# EAGLE design PCB-CMB-3 (EAGLE 6.5.0)

## Sheet 1 of 2
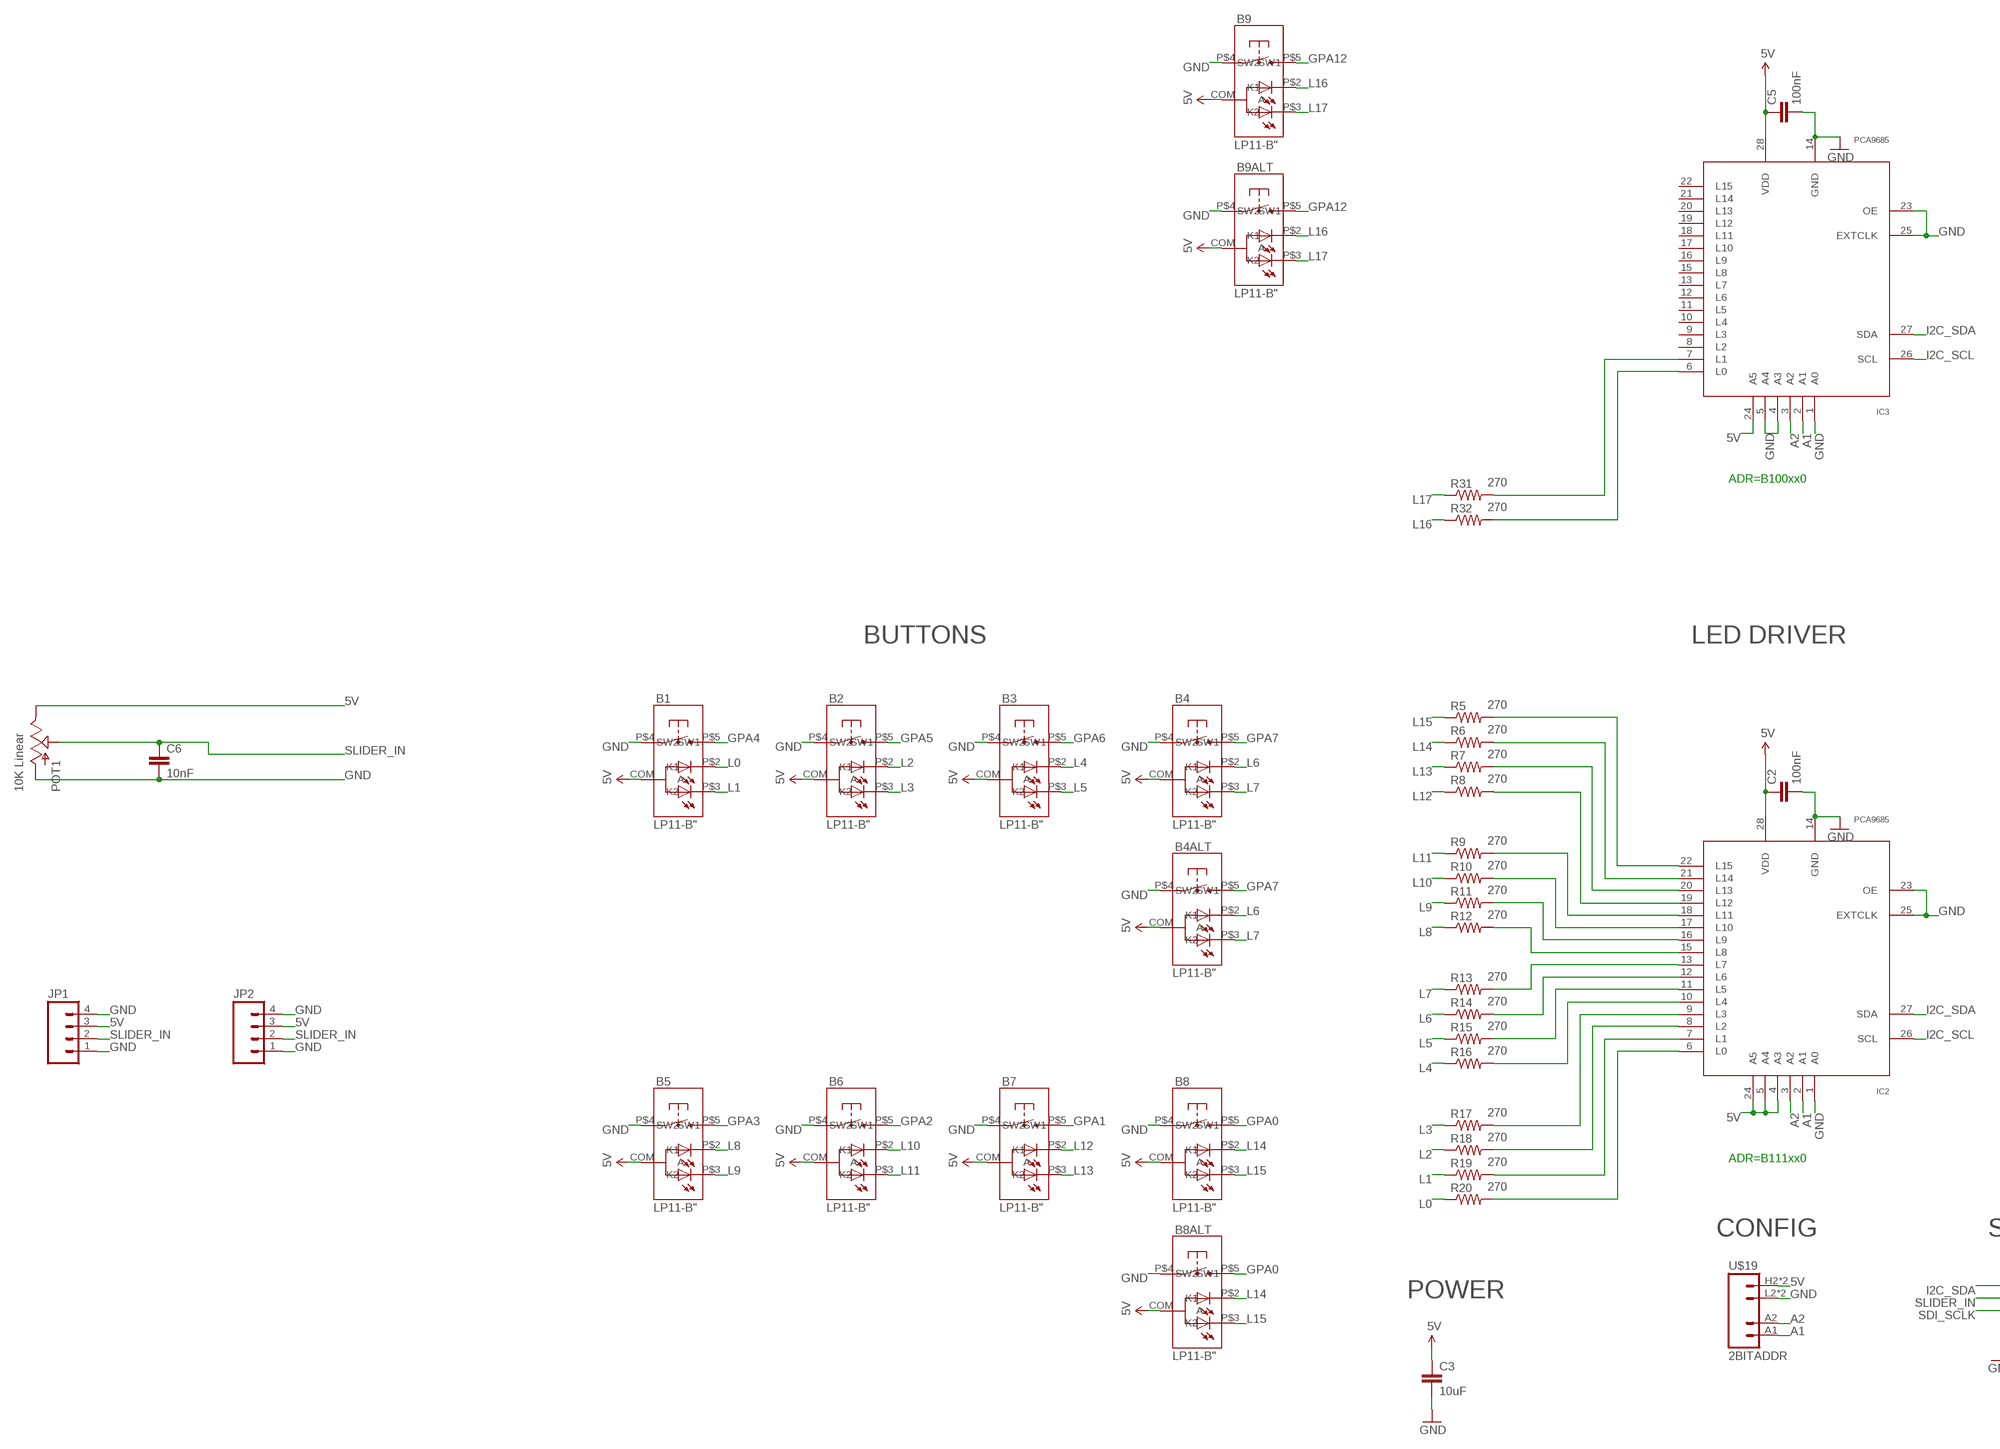
[diagram p0: schematic, sheet 1, part 1 of 2]
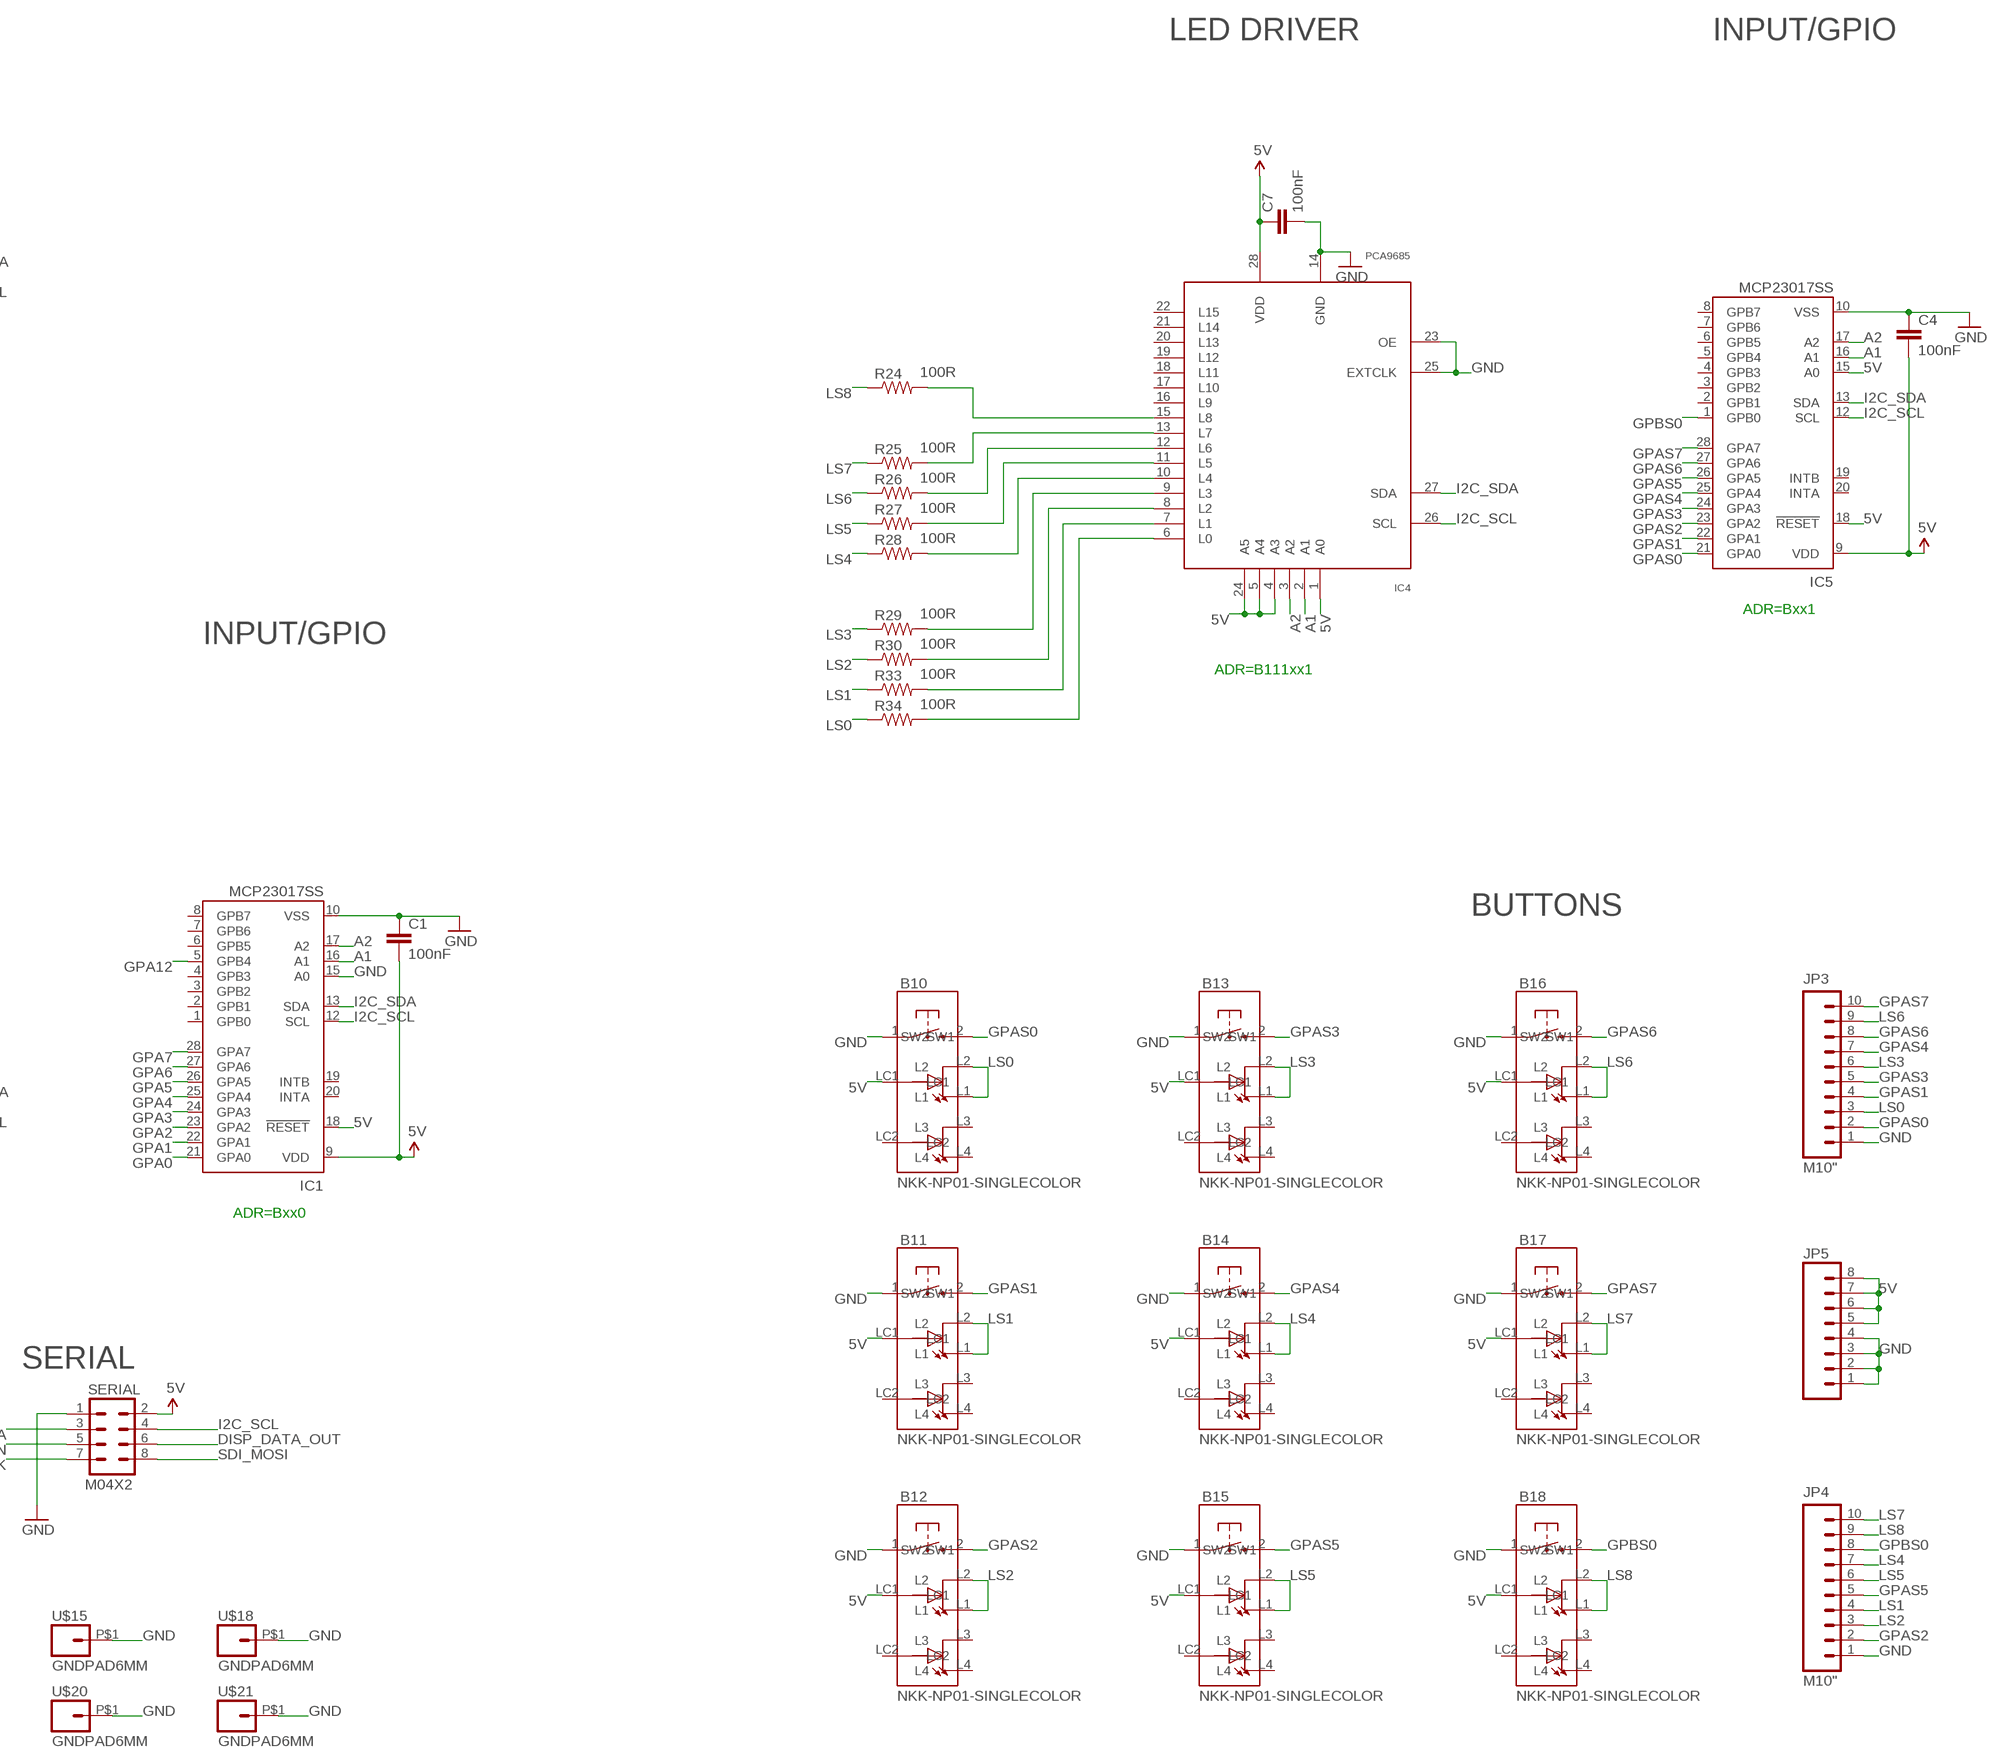
[diagram p1: schematic, sheet 1, part 2 of 2]

### Parts
B1  LP11-B"  [LP11]
B2  LP11-B"  [LP11]
B3  LP11-B"  [LP11]
B4  LP11-B"  [LP11]
B4ALT  LP11-B"  [LP11]
B5  LP11-B"  [LP11]
B6  LP11-B"  [LP11]
B7  LP11-B"  [LP11]
B8  LP11-B"  [LP11]
B8ALT  LP11-B"  [LP11]
B9  LP11-B"  [LP11]
B9ALT  LP11-B"  [LP11]
B10  NKK-NP01-SINGLECOLOR  [NKK-NP01]
B11  NKK-NP01-SINGLECOLOR  [NKK-NP01]
B12  NKK-NP01-SINGLECOLOR  [NKK-NP01]
B13  NKK-NP01-SINGLECOLOR  [NKK-NP01]
B14  NKK-NP01-SINGLECOLOR  [NKK-NP01]
B15  NKK-NP01-SINGLECOLOR  [NKK-NP01]
B16  NKK-NP01-SINGLECOLOR  [NKK-NP01]
B17  NKK-NP01-SINGLECOLOR  [NKK-NP01]
B18  NKK-NP01-SINGLECOLOR  [NKK-NP01]
C1  100nF  CAP0603-CAP  [0603-CAP]
C2  100nF  CAP0603-CAP  [0603-CAP]
C3  10uF  CAP0805  [0805]
C4  100nF  CAP0603-CAP  [0603-CAP]
C5  100nF  CAP0603-CAP  [0603-CAP]
C6  10nF  CAP0603-CAP  [0603-CAP]
C7  100nF  CAP0603-CAP  [0603-CAP]
IC1  MCP23017SS  [SSOP28]
IC2  PCA9685  [TSSOP28]
IC3  PCA9685  [TSSOP28]
IC4  PCA9685  [TSSOP28]
IC5  MCP23017SS  [SSOP28]
JP1  M04PTH  [1X04]
JP2  M04PTH  [1X04]
JP3  M10"  [1X10]
JP4  M10"  [1X10]
JP5  M08LOCK  [1X08_LOCK]
POT1  10K Linear  SLIDER20  [SLIDER20]
R5  270  RESISTOR0603-RES  [0603-RES]
R6  270  RESISTOR0603-RES  [0603-RES]
R7  270  RESISTOR0603-RES  [0603-RES]
R8  270  RESISTOR0603-RES  [0603-RES]
R9  270  RESISTOR0603-RES  [0603-RES]
R10  270  RESISTOR0603-RES  [0603-RES]
R11  270  RESISTOR0603-RES  [0603-RES]
R12  270  RESISTOR0603-RES  [0603-RES]
R13  270  RESISTOR0603-RES  [0603-RES]
R14  270  RESISTOR0603-RES  [0603-RES]
R15  270  RESISTOR0603-RES  [0603-RES]
R16  270  RESISTOR0603-RES  [0603-RES]
R17  270  RESISTOR0603-RES  [0603-RES]
R18  270  RESISTOR0603-RES  [0603-RES]
R19  270  RESISTOR0603-RES  [0603-RES]
R20  270  RESISTOR0603-RES  [0603-RES]
R24  100R  RESISTOR0603-RES  [0603-RES]
R25  100R  RESISTOR0603-RES  [0603-RES]
R26  100R  RESISTOR0603-RES  [0603-RES]
R27  100R  RESISTOR0603-RES  [0603-RES]
R28  100R  RESISTOR0603-RES  [0603-RES]
R29  100R  RESISTOR0603-RES  [0603-RES]
R30  100R  RESISTOR0603-RES  [0603-RES]
R31  270  RESISTOR0603-RES  [0603-RES]
R32  270  RESISTOR0603-RES  [0603-RES]
R33  100R  RESISTOR0603-RES  [0603-RES]
R34  100R  RESISTOR0603-RES  [0603-RES]
SERIAL  M04X2  [2X4]
U$15  GNDPAD6MM  [3.2MMPAD6MM]
U$18  GNDPAD6MM  [3.2MMPAD6MM]
U$19  2BITADDR  [2BITADDR]
U$20  GNDPAD6MM  [3.2MMPAD6MM]
U$21  GNDPAD6MM  [3.2MMPAD6MM]

### Nets
5V [Power]: B1.COM(A) B2.COM(A) B3.COM(A) B4.COM(A) B4ALT.COM(A) B5.COM(A) B6.COM(A) B7.COM(A) B8.COM(A) B8ALT.COM(A) B9.COM(A) B9ALT.COM(A) B10.LC1 B11.LC1 B12.LC1 B13.LC1 B14.LC1 B15.LC1 B16.LC1 B17.LC1 B18.LC1 C1.2 C2.1 C3.1 C4.2 C5.1 C7.1 IC1.9(VDD) IC1.18(!RESET) IC2.4(A3) IC2.5(A4) IC2.24(A5) IC2.28(VDD) IC3.24(A5) IC3.28(VDD) IC4.1(A0) IC4.4(A3) IC4.5(A4) IC4.24(A5) IC4.28(VDD) IC5.9(VDD) IC5.15(A0) IC5.18(!RESET) JP1.3 JP2.3 JP5.5 JP5.6 JP5.7 JP5.8 POT1.1(E) SERIAL.2 U$19.H2(VCC) U$19.H3(VCC)
A1: IC1.16(A1) IC2.2(A1) IC3.2(A1) IC4.2(A1) IC5.16(A1) U$19.A1
A2: IC1.17(A2) IC2.3(A2) IC3.3(A2) IC4.3(A2) IC5.17(A2) U$19.A2
DISP_DATA_OUT: SERIAL.6
GND [Power]: B1.P$4(SW1) B2.P$4(SW1) B3.P$4(SW1) B4.P$4(SW1) B4ALT.P$4(SW1) B5.P$4(SW1) B6.P$4(SW1) B7.P$4(SW1) B8.P$4(SW1) B8ALT.P$4(SW1) B9.P$4(SW1) B9ALT.P$4(SW1) B10.1(SW1) B11.1(SW1) B12.1(SW1) B13.1(SW1) B14.1(SW1) B15.1(SW1) B16.1(SW1) B17.1(SW1) B18.1(SW1) C1.1 C2.2 C3.2 C4.1 C5.2 C6.2 C7.2 IC1.10(VSS) IC1.15(A0) IC2.1(A0) IC2.14(GND) IC2.23(OE) IC2.25(EXTCLK) IC3.1(A0) IC3.4(A3) IC3.5(A4) IC3.14(GND) IC3.23(OE) IC3.25(EXTCLK) IC4.14(GND) IC4.23(OE) IC4.25(EXTCLK) IC5.10(VSS) JP1.1 JP1.4 JP2.1 JP2.4 JP3.1 JP4.1 JP5.1 JP5.2 JP5.3 JP5.4 POT1.3(A) SERIAL.1 U$15.P$1 U$18.P$1 U$19.L2(GND) U$19.L3(GND) U$20.P$1 U$21.P$1
GPA0: B8.P$5(SW2) B8ALT.P$5(SW2) IC1.21(GPA0)
GPA1: B7.P$5(SW2) IC1.22(GPA1)
GPA2: B6.P$5(SW2) IC1.23(GPA2)
GPA3: B5.P$5(SW2) IC1.24(GPA3)
GPA4: B1.P$5(SW2) IC1.25(GPA4)
GPA5: B2.P$5(SW2) IC1.26(GPA5)
GPA6: B3.P$5(SW2) IC1.27(GPA6)
GPA7: B4.P$5(SW2) B4ALT.P$5(SW2) IC1.28(GPA7)
GPA12: B9.P$5(SW2) B9ALT.P$5(SW2) IC1.5(GPB4)
GPAS0: B10.2(SW2) IC5.21(GPA0) JP3.2
GPAS1: B11.2(SW2) IC5.22(GPA1) JP3.4
GPAS2: B12.2(SW2) IC5.23(GPA2) JP4.2
GPAS3: B13.2(SW2) IC5.24(GPA3) JP3.5
GPAS4: B14.2(SW2) IC5.25(GPA4) JP3.7
GPAS5: B15.2(SW2) IC5.26(GPA5) JP4.5
GPAS6: B16.2(SW2) IC5.27(GPA6) JP3.8
GPAS7: B17.2(SW2) IC5.28(GPA7) JP3.10
GPBS0 [Power]: B18.2(SW2) IC5.1(GPB0) JP4.8
I2C_SCL: IC1.12(SCL) IC2.26(SCL) IC3.26(SCL) IC4.26(SCL) IC5.12(SCL) SERIAL.4
I2C_SDA: IC1.13(SDA) IC2.27(SDA) IC3.27(SDA) IC4.27(SDA) IC5.13(SDA) SERIAL.3
L0: B1.P$2(K1) R20.1
L1: B1.P$3(K2) R19.1
L2: B2.P$2(K1) R18.1
L3: B2.P$3(K2) R17.1
L4: B3.P$2(K1) R16.1
L5: B3.P$3(K2) R15.1
L6: B4.P$2(K1) B4ALT.P$2(K1) R14.1
L7: B4.P$3(K2) B4ALT.P$3(K2) R13.1
L8: B5.P$2(K1) R12.1
L9: B5.P$3(K2) R11.1
L10: B6.P$2(K1) R10.1
L11: B6.P$3(K2) R9.1
L12: B7.P$2(K1) R8.1
L13: B7.P$3(K2) R7.1
L14: B8.P$2(K1) B8ALT.P$2(K1) R6.1
L15: B8.P$3(K2) B8ALT.P$3(K2) R5.1
L16: B9.P$2(K1) B9ALT.P$2(K1) R32.1
L17: B9.P$3(K2) B9ALT.P$3(K2) R31.1
LS0: B10.L1 B10.L2 JP3.3 R34.1
LS1: B11.L1 B11.L2 JP4.4 R33.1
LS2: B12.L1 B12.L2 JP4.3 R30.1
LS3: B13.L1 B13.L2 JP3.6 R29.1
LS4: B14.L1 B14.L2 JP4.7 R28.1
LS5: B15.L1 B15.L2 JP4.6 R27.1
LS6: B16.L1 B16.L2 JP3.9 R26.1
LS7: B17.L1 B17.L2 JP4.10 R25.1
LS8: B18.L1 B18.L2 JP4.9 R24.1
N$1: IC4.13(L7) R25.2
N$2: IC4.12(L6) R26.2
N$3: IC4.11(L5) R27.2
N$4: IC2.13(L7) R13.2
N$5: IC2.12(L6) R14.2
N$6: IC4.10(L4) R28.2
N$7: IC2.11(L5) R15.2
N$8: IC4.9(L3) R29.2
N$9: IC2.10(L4) R16.2
N$10: IC2.9(L3) R17.2
N$11: IC2.8(L2) R18.2
N$12: IC2.7(L1) R19.2
N$13: IC4.8(L2) R30.2
N$14: IC3.7(L1) R31.2
N$15: IC3.6(L0) R32.2
N$16: IC4.7(L1) R33.2
N$17: IC4.6(L0) R34.2
N$18: IC4.15(L8) R24.2
N$19: IC2.6(L0) R20.2
N$20: IC2.15(L8) R12.2
N$21: IC2.16(L9) R11.2
N$22: IC2.17(L10) R10.2
N$23: IC2.18(L11) R9.2
N$24: IC2.19(L12) R8.2
N$25: IC2.20(L13) R7.2
N$26: IC2.21(L14) R6.2
N$27: IC2.22(L15) R5.2
SDI_MOSI: SERIAL.8
SDI_SCLK: SERIAL.7
SLIDER_IN: C6.1 JP1.2 JP2.2 POT1.2A(S) SERIAL.5
Unconnected: B10.L3 B10.L4 B10.LC2 B11.L3 B11.L4 B11.LC2 B12.L3 B12.L4 B12.LC2 B13.L3 B13.L4 B13.LC2 B14.L3 B14.L4 B14.LC2 B15.L3 B15.L4 B15.LC2 B16.L3 B16.L4 B16.LC2 B17.L3 B17.L4 B17.LC2 B18.L3 B18.L4 B18.LC2 IC1.1(GPB0) IC1.2(GPB1) IC1.3(GPB2) IC1.4(GPB3) IC1.6(GPB5) IC1.7(GPB6) IC1.8(GPB7) IC1.19(INTB) IC1.20(INTA) IC3.8(L2) IC3.9(L3) IC3.10(L4) IC3.11(L5) IC3.12(L6) IC3.13(L7) IC3.15(L8) IC3.16(L9) IC3.17(L10) IC3.18(L11) IC3.19(L12) IC3.20(L13) IC3.21(L14) IC3.22(L15) IC4.16(L9) IC4.17(L10) IC4.18(L11) IC4.19(L12) IC4.20(L13) IC4.21(L14) IC4.22(L15) IC5.2(GPB1) IC5.3(GPB2) IC5.4(GPB3) IC5.5(GPB4) IC5.6(GPB5) IC5.7(GPB6) IC5.8(GPB7) IC5.19(INTB) IC5.20(INTA)

### Notes on the sheet
- LED DRIVER | INPUT/GPIO
- ADR=B100xx0
- ADR=Bxx1
- BUTTONS | LED DRIVER | INPUT/GPIO
- ADR=B111xx1
- BUTTONS
- ADR=Bxx0
- ADR=B111xx0
- CONFIG | SERIAL
- POWER

## Sheet 2 of 2

## Library data of the parts
B1-B4 B4ALT B5-B8 B8ALT B9 B9ALT = SKAARHOJ:LP11-B
B10-B18 = SKAARHOJ:NKK-NP01-SINGLECOLOR
C1-C7 = SparkFun:CAP: Capacitor Standard 0603 ceramic capacitor, and 0.1" leaded capacitor.
IC1 IC5 = microchip:MCP23017: http://ww1.microchip.com/downloads/en/DeviceDoc/21952a.pdf Source: http://ww1.microchip.com/downloads/en/DeviceDoc/21952a.pdf; MF: MICROCHIP; MPN: MCP23017-E/SS; OC_FARNELL: 1467674; OC_NEWARK: 31K2960
IC2-IC4 = wsmith:PCA9685
JP1 JP2 = SparkFun:M04: Header 4 Standard 4-pin 0.1" header. Use with straight break away headers (SKU : PRT-00116), right angle break away headers (PRT-00553), swiss pins (PRT-00743), machine pins (PRT-00117), and female headers (PRT-00115). Molex polarized connector foot print use with SKU : PRT-08231 with associated crimp pins and housings. 1MM SMD Version SKU: PRT-10208
JP3 JP4 = SparkFun:M10: Header 10 Standard 10-pin 0.1" header. Use with straight break away headers (SKU : PRT-00116), right angle break away headers (PRT-00553), swiss pins (PRT-00743), machine pins (PRT-00117), and female headers (PRT-00115).
JP5 = SparkFun:M08: Header 8 Standard 8-pin 0.1" header. Use with straight break away headers (SKU : PRT-00116), right angle break away headers (PRT-00553), swiss pins (PRT-00743), machine pins (PRT-00117), and female headers (PRT-00115).
POT1 = SKAARHOJ:SLIDER
R5-R20 R24-R34 = SparkFun:RESISTOR: Resistor Basic schematic elements and footprints for 0603, 1206, and PTH resistors.
SERIAL = SparkFun:M04X2
U$15 U$18 U$20 U$21 = SKAARHOJ:GNDPAD
U$19 = SKAARHOJ:2BITADDR

## Net classes
0 default: width 0.203 mm, drill 0.406 mm, clearance 0.203 mm
1 Power: width 0.406 mm, drill 0.61 mm, clearance 0.203 mm

## Board
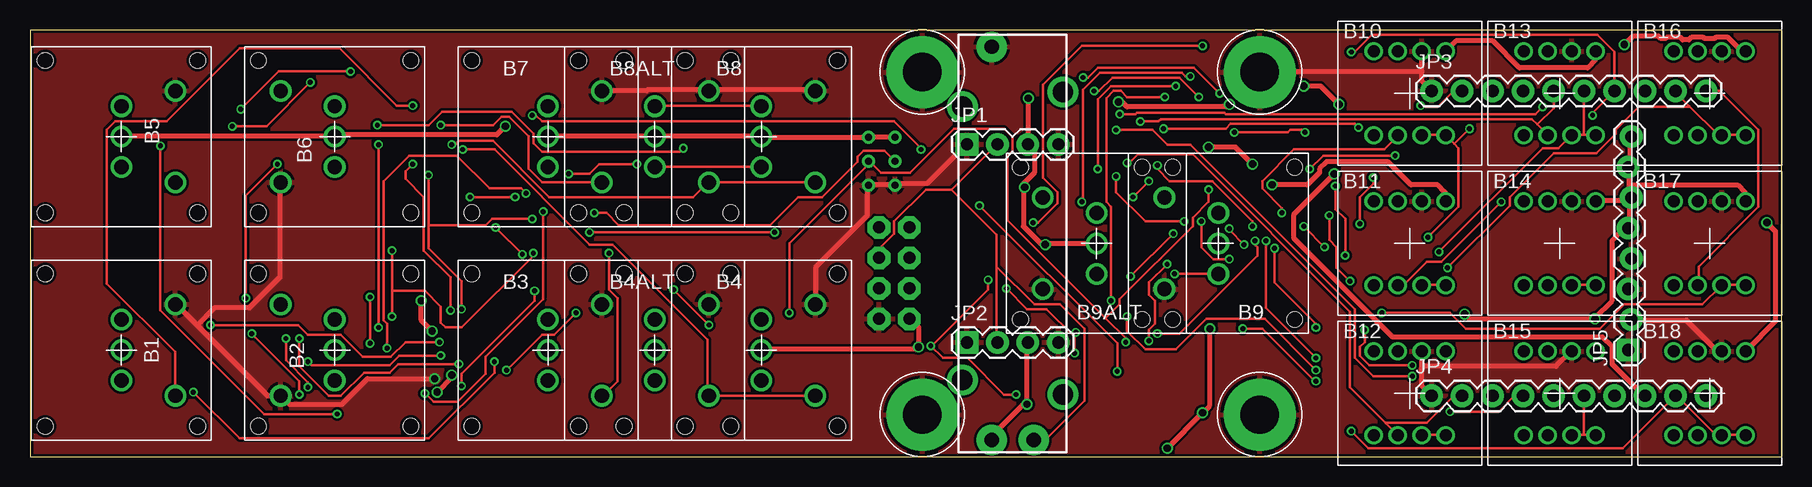
[diagram p2: board, top side]
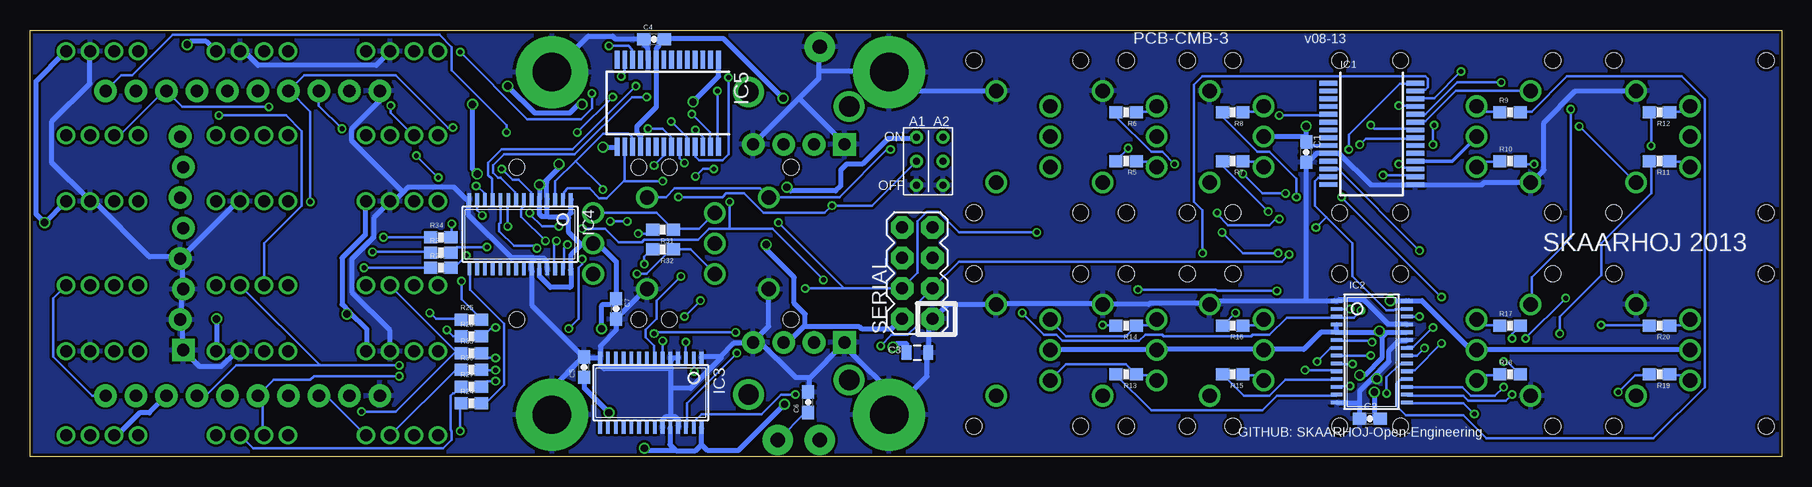
[diagram p3: board, bottom side, seen from below]

Size 146 x 35.56 mm. Coordinates in mm from the lower left corner, seen from the top.
Outline: 0,0 146,0 146,35.56 0,35.56 0,0
Copper layers (1*16): Top 0.035mm / dielectric 1.5mm / Bottom 0.035mm
Design rules "Fusion_eagle_rule_v1.1": minimum track width 6mil, minimum drill 12mil, track to track 6mil, track to pad 6mil, pad to pad 6mil, via to via 6mil, smd to smd 0mil, copper to edge 10mil, drill to drill 10mil, minimum pad ring 10mil, minimum via ring 6mil, stop-mask expansion 2mil, vias tented up to drill 100mil, thermal gap 10mil

### Footprints (pad centres in the part's own frame; a part is rotated, then mirrored left to right if it is on the bottom)
LP11 = drill 1.2: COM 0,0; P$2 0,2.54; P$3 0,-2.54; P$4 4.5,3.81; P$5 4.5,-3.81 | hole 1.3: -6.35,6.35; 6.35,6.35; 6.35,-6.35; -6.35,-6.35
NKK-NP01 = drill 1: 1 1,3.5; 2 -1,-3.5; L1 3,-3.5; L2 1,-3.5; L3 -1,3.5; L4 -3,3.5; LC1 3,3.5; LC2 -3,-3.5
0603-CAP = smd 1.1 x 1: 1 -0.85,0; 2 0.85,0
0805 = smd 0.8 x 1.2: 1 -0.9,0; 2 0.9,0
SSOP28 = smd 0.4 x 1.5: 1 -4.225,-3.625; 2 -3.575,-3.625; 3 -2.925,-3.625; 4 -2.275,-3.625; 5 -1.625,-3.625; 6 -0.975,-3.625; 7 -0.325,-3.625; 8 0.325,-3.625; 9 0.975,-3.625; 10 1.625,-3.625; 11 2.275,-3.625; 12 2.925,-3.625; 13 3.575,-3.625; 14 4.225,-3.625; 15 4.225,3.625; 16 3.575,3.625; 17 2.925,3.625; 18 2.275,3.625; 19 1.625,3.625; 20 0.975,3.625; 21 0.325,3.625; 22 -0.325,3.625; 23 -0.975,3.625; 24 -1.625,3.625; 25 -2.275,3.625; 26 -2.925,3.625; 27 -3.575,3.625; 28 -4.225,3.625
TSSOP28 = smd 0.305 x 0.991: 1 -4.225,-2.918; 2 -3.575,-2.918; 3 -2.925,-2.918; 4 -2.275,-2.918; 5 -1.625,-2.918; 6 -0.975,-2.918; 7 -0.325,-2.918; 8 0.325,-2.918; 9 0.975,-2.918; 10 1.625,-2.918; 11 2.275,-2.918; 12 2.925,-2.918; 13 3.575,-2.918; 14 4.225,-2.918; 15 4.225,2.918; 16 3.575,2.918; 17 2.925,2.918; 18 2.275,2.918; 19 1.625,2.918; 20 0.975,2.918; 21 0.325,2.918; 22 -0.325,2.918; 23 -0.975,2.918; 24 -1.625,2.918; 25 -2.275,2.918; 26 -2.925,2.918; 27 -3.575,2.918; 28 -4.225,2.918
1X04 = drill 1.016 pad 1.88 square: 1 0,0 | drill 1.016 pad 1.88: 2 2.54,0; 3 5.08,0; 4 7.62,0
1X10 = drill 1.016 pad 1.88: 1 0,0; 2 2.54,0; 3 5.08,0; 4 7.62,0; 5 10.16,0; 6 12.7,0; 7 15.24,0; 8 17.78,0; 9 20.32,0; 10 22.86,0
1X08_LOCK = drill 1.016 pad 1.88 square: 1 0,0.127 | drill 1.016 pad 1.88: 2 2.54,-0.127; 3 5.08,0.127; 4 7.62,-0.127; 5 10.16,0.127; 6 12.7,-0.127; 7 15.24,0.127; 8 17.78,-0.127
SLIDER20 = drill 1.194 pad 2.54: 1 -16.383,1.74; 2A -16.383,-1.74; 3 16.383,1.74 | drill 1.702: P$1 -11.392,4.191; P$2 11.392,4.191; P$3 12.598,-4.191; P$4 -12.598,-4.191
0603-RES = smd 1.1 x 1: 1 -0.85,0; 2 0.85,0
2X4 = drill 1.016 pad 1.88 octagon: 1 -3.81,-1.27; 2 -3.81,1.27; 3 -1.27,-1.27; 4 -1.27,1.27; 5 1.27,-1.27; 6 1.27,1.27; 7 3.81,-1.27; 8 3.81,1.27
3.2MMPAD6MM = drill 3.2 pad 6: P$1 0,0
2BITADDR = drill 0.6: A1 0,0; A2 2.2,0; H2 0,2; H3 2.2,2; L2 0,-2; L3 2.2,-2

### Placement (x,y rotation side)
B1  7.62,8.89 0 top
B2  25.4,8.89 180 top
B3  43.18,8.89 0 top
B4  60.96,8.89 0 top
B4ALT  52.07,8.89 0 top
B5  7.62,26.67 0 top
B6  25.4,26.67 180 top
B7  43.18,26.67 0 top
B8  60.96,26.67 0 top
B8ALT  52.07,26.67 0 top
B9  99.06,17.78 180 top
B9ALT  88.9,17.78 180 top
B10  115,30.28 0 top
B11  115,17.78 0 top
B12  115,5.28 0 top
B13  127.5,30.28 0 top
B14  127.5,17.78 0 top
B15  127.5,5.28 0 top
B16  140,30.28 0 top
B17  140,17.78 0 top
B18  140,5.28 0 top
C1  39.62,25.38 90 bottom
C2  34.32,3.16 180 bottom
C3  72.04,8.67 0 bottom
C4  93.98,34.8 0 bottom
C5  99.81,7.47 90 bottom
C6  81.13,4.54 90 bottom
C7  97.16,12.32 270 bottom
IC1  34.16,26.91 270 bottom
IC2  34.16,8.75 270 bottom
IC3  94.25,5.33 180 bottom
IC4  105.16,18.54 180 bottom
IC5  92.84,29.46 180 bottom
JP1  78.11,26.04 0 top
JP2  78.11,9.53 0 top
JP3  116.84,30.48 0 top
JP4  116.84,5.08 0 top
JP5  133.35,8.89 90 top
POT1  81.92,17.78 90 top
R5  54.63,24.64 180 bottom
R6  54.63,28.7 180 bottom
R7  45.74,24.64 180 bottom
R8  45.74,28.7 180 bottom
R9  22.62,28.7 0 bottom
R10  22.62,24.64 0 bottom
R11  10.18,24.64 180 bottom
R12  10.18,28.7 180 bottom
R13  54.63,6.86 180 bottom
R14  54.63,10.92 180 bottom
R15  45.74,6.86 180 bottom
R16  45.74,10.92 180 bottom
R17  22.62,10.92 0 bottom
R18  22.62,6.86 0 bottom
R19  10.18,6.86 180 bottom
R20  10.18,10.92 180 bottom
R24  109.22,4.45 0 bottom
R25  109.22,11.43 0 bottom
R26  111.76,15.75 0 bottom
R27  109.22,5.84 0 bottom
R28  109.22,10.03 0 bottom
R29  111.76,17.02 0 bottom
R30  109.22,7.24 0 bottom
R31  93.23,18.92 180 bottom
R32  93.23,17.27 180 bottom
R33  109.22,8.64 0 bottom
R34  111.76,18.29 0 bottom
SERIAL  72.04,15.3 90 bottom
U$15  74.39,3.5 0 top
U$18  102.5,3.5 0 top
U$19  72.1,24.62 0 bottom
U$20  74.39,32.06 0 top
U$21  102.5,32.06 0 top

### Tracks (layer width: path | path; a pad name or v marks a point on that pad's centre or on a via)
5V  (via drill 0.61)
  Top 0.406: B10.LC1 118.06,33.83 118.87,34.65 121.92,34.65 124.16,32.41 129.84,32.41 130.45,33.02 130.45,33.73 B13.LC1 | v144.78,19.51 145.49,18.8 145.49,11.28 143.05,8.84 B18.LC1 | v132.89,34.34 133.6,35.05 135.74,35.05 135.94,34.85 136.35,34.85 136.45,34.95 137.57,34.95 137.77,34.75 138.28,34.75 138.48,34.95 139.5,34.95 139.6,34.85 140.41,34.85 140.51,34.95 141.53,34.95 142.65,33.83 142.95,33.83 B16.LC1 | v98.25,25.81 100.48,25.81 v101.91,24.38 | B14.LC1 130.56,21.34 133.2,21.34 133.4,21.54 JP5.6 | JP5.6 133.3,21.23 133.3,19.1 JP5.5 133.1,18.9 132.79,18.9 131.88,17.98 131.88,13.01 130.45,11.58 v130.45,11.48 119.99,11.48 v119.58,11.89 | 133.3,22.66 133.3,21.64 JP5.6 | 133.3,22.66 133.3,24.08 JP5.7 133.4,24.18 133.4,26.62 JP5.8 | v103.53,22.66 106.48,22.66 107.49,23.67 107.49,23.98 108.1,24.59 113.18,24.59 115.11,22.66 117.35,22.66 117.96,22.05 117.96,21.34 B11.LC1 | 133.3,22.66 142.34,22.66 142.95,22.05 142.95,21.34 B17.LC1 | v32.61,13.01 32.61,11.38 v33.53,10.46 | v33.93,5.38 35.15,6.6 v35.15,6.81 | 84.63,17.78 84.23,17.78 82.8,19.2 82.8,22.45 | 84.63,17.78 B9ALT.COM | 82.8,22.45 82.8,22.76 83.72,23.67 83.72,25.5 JP1.3 83.21,26.21 v83.21,29.87 | v94.79,0.71 v97.74,3.66 98.35,4.27 v98.35,10.67 | SERIAL.2 73.36,11.48 74.07,10.77 v74.07,9.14 73.86,8.94 60.96,8.94 B4.COM | 82.91,4.47 80.26,1.83 80.26,1.42 POT1.1 | 82.91,4.47 83.11,4.67 83.11,9.45 JP2.3 | v83.11,4.37 83.01,4.37 82.91,4.47 | v84.63,17.68 84.63,17.78 | B5.COM 7.62,26.72 25.4,26.72 B6.COM 25.5,26.82 38.91,26.82 v39.62,27.53 | U$19.H2 72.03,26.62 70,26.62 U$19.H3 69.8,26.62 60.96,26.62 B8.COM 60.86,26.72 52.12,26.72 B8ALT.COM 51.92,26.72 43.18,26.72 B7.COM
  Top 0.406: v82.91,22.45 82.8,22.45
  Bottom 0.305: IC1.9 39.62,25.93 C1.2 | IC1.18 27.44,24.63 B6.COM
  Bottom 0.406: B17.LC1 143.05,21.23 v144.78,19.51 145.49,20.22 145.49,31.29 143.05,33.73 B16.LC1 | v132.89,34.34 132.59,34.65 131.37,34.65 130.56,33.83 B13.LC1 | 101.19,20.02 100.89,20.32 100.89,21.44 IC4.1 | 101.19,20.02 102.82,20.02 102.92,20.12 | 102.92,20.12 102.92,21.44 IC4.4 102.92,21.64 102.92,22.86 103.02,22.96 101.91,24.08 v101.91,24.38 | 102.92,20.12 103.02,20.02 103.33,20.02 103.53,20.22 103.53,21.44 IC4.5 103.53,21.64 v103.53,22.66 | v98.25,25.81 97.13,25.81 IC5.15 | 100.08,17.68 100.89,16.87 100.89,15.65 IC4.28 100.89,15.44 100.89,14.22 100.99,14.12 102.62,14.12 103.53,15.04 103.53,15.54 IC4.24 | 100.08,17.68 99.97,17.78 B9.COM 98.96,17.68 98.55,17.68 97.13,16.26 97.13,13.21 C7.1 97.13,13.01 97.13,12.7 98.25,12.7 98.35,12.6 v98.35,10.67 | 100.08,17.68 101.09,18.69 101.09,19.91 101.19,20.02 | 119.38,12.09 119.99,12.7 119.99,16.56 118.06,18.49 118.06,21.23 B11.LC1 | 119.38,12.09 117.96,10.67 117.96,8.84 B12.LC1 | v130.45,11.48 130.45,8.84 B15.LC1 | v119.58,11.89 119.38,12.09 | B1.COM 7.62,8.94 25.4,8.94 B2.COM 25.5,9.04 26.01,9.04 29.97,13.01 31.09,13.01 IC2.28 31.29,13.01 v32.61,13.01 | B4.COM 60.96,8.94 52.12,8.94 B4ALT.COM 51.92,8.94 43.28,8.94 B3.COM 43.18,8.94 39.83,8.94 38.41,10.36 37.19,10.36 IC2.5 | 33.53,10.36 36.98,10.36 IC2.5 | 33.53,10.36 33.02,10.36 | 33.02,10.36 31.29,10.36 IC2.24 | v33.53,10.46 33.53,10.36 | IC2.4 37.08,10.97 37.08,10.57 IC2.5 | v33.93,5.38 33.93,3.15 33.53,3.15 C2.1 | v35.15,6.81 34.75,6.81 33.33,8.23 33.33,9.96 33.02,10.26 33.02,10.36 | IC5.18 95.1,25.91 95.1,26.72 95.4,27.03 95.4,27.53 93.78,29.16 93.78,32.92 IC5.9 93.78,33.12 93.78,34.04 93.57,34.24 93.57,34.85 93.17,34.85 C4.2 92.96,34.85 88.19,34.85 v83.21,29.87
  Bottom 0.406: 90.02,1.02 90.02,2.34 IC3.28 | 90.02,1.02 90.53,0.51 92.15,0.51 92.25,0.61 | 92.25,0.61 92.66,1.02 92.66,2.34 IC3.24 | v97.74,3.66 99.77,5.69 99.77,6.6 C5.1 | v94.79,0.71 94.59,0.51 92.35,0.51 92.25,0.61 | v74.07,9.14 73.76,9.45 72.95,9.45 72.95,8.74 C3.1 | 81.38,10.87 81.48,10.87 82.8,9.55 83.11,9.55 JP2.3 | 81.38,10.87 76.91,10.87 76.71,10.67 74.17,10.67 73.36,11.48 SERIAL.2 | 90.02,1.02 89.51,0.51 86.97,0.51 v83.11,4.37 | v84.63,17.68 84.63,17.27 82.3,14.94 82.3,12.8 81.38,11.89 81.38,10.87 | 39.62,26.72 C1.2 | 39.62,26.72 43.18,26.72 B7.COM | 39.62,26.72 v39.62,27.53 | v82.91,22.45 82.6,22.15 78.84,22.15 78.44,22.55 78.44,23.88 77.93,24.38 76.61,24.38 74.47,26.52 72.14,26.52 U$19.H2
A1  (via drill 0.41)
  Top 0.203: v35.97,12.29 35.97,14.63 33.22,17.37 33.22,19.3 | v33.22,23.47 33.22,19.3 | v90.63,7.11 90.63,9.45 v79.15,20.93 | v91.95,21.64 v93.27,22.96 | 33.22,19.3 38,19.3 38.51,19.81 v41.86,19.81 | v47.04,20.32 48.06,20.32 49.07,19.3 61.67,19.3 64.01,21.64 66.04,21.64 68.99,24.59 68.99,24.99 69.49,25.5 71.22,25.5 72.03,24.69 U$19.A1
  Bottom 0.203: v35.97,12.29 36.98,12.29 IC2.2 | v33.22,23.47 30.68,23.47 30.58,23.37 IC1.16 | 96.47,23.01 96.42,23.06 96.42,25.81 IC5.16 | 96.47,23.01 97.94,21.54 98.55,21.54 99.36,22.35 101.19,22.35 101.5,22.05 101.5,21.54 IC4.2 | v90.63,7.11 90.63,8.23 IC3.2 | U$19.A1 72.14,24.59 75.79,20.93 v79.15,20.93 79.76,20.32 84.84,20.32 86.46,21.95 87.99,21.95 88.29,21.64 v91.95,21.64 | v93.27,22.96 96.42,22.96 96.47,23.01 | v41.86,19.81 42.16,19.81 42.67,19.3 46.13,19.3 47.04,20.22 v47.04,20.32
A2  (via drill 0.41)
  Top 0.203: v35.05,12.19 35.05,14.94 32.82,17.17 32.82,21.64 31.29,23.16 31.29,23.77 v31.9,24.38 | v91.34,9.55 91.34,9.86 89.66,11.53 | 89.66,11.53 81.48,19.71 81.48,25.09 81.89,25.5 81.89,26.62 81.18,27.33 77.01,27.33 73.36,23.67 70.92,23.67 70,24.59 U$19.A2 70,24.49 63.3,17.78 v63.3,11.99 | v98.25,22.25 98.25,21.23 96.93,19.91 96.93,19.2 90.83,13.11 90.83,12.7 89.66,11.53
  Bottom 0.203: v35.05,12.19 35.66,11.58 36.98,11.58 IC2.3 37.08,11.58 41.25,11.58 42.67,10.16 44.09,10.16 44.2,10.06 51.51,10.06 51.61,10.16 53.03,10.16 53.54,9.65 59.94,9.65 60.45,10.16 61.47,10.16 v63.3,11.99 | v31.9,24.38 31.7,24.38 31.39,24.08 30.58,24.08 IC1.17 | 100.53,24.64 98.25,26.92 96.11,26.92 95.81,26.62 95.81,25.91 IC5.17 | 100.53,24.64 102.21,22.96 102.21,21.54 IC4.3 | v91.34,9.55 91.34,8.33 IC3.3 | 100.53,24.64 98.25,22.35 v98.25,22.25
GND  (via drill 0.61)
  Top 0.406: 116.03,7.52 116.03,5.89 JP4.1 | 116.03,7.52 116.03,8.74 B12.1 | 116.03,7.52 127.2,7.52 128.42,8.74 B15.1 | B18.1 140.92,8.84 140.61,8.84 138.07,11.38 133.5,11.38 JP5.2 | 116.03,32.11 116.03,31.29 JP3.1 | 116.03,32.11 116.03,33.73 B10.1 | 116.03,32.11 102.51,32.11 U$21.P$1 | JP1.1 78.03,26.01 74.78,22.76 72.24,22.76 U$19.L2 72.03,22.66 70,22.66 U$19.L3 69.8,22.45 69.8,20.12 65.53,15.85 65.53,12.7 B4.P$4 | B7.P$4 51.41,30.48 51.51,30.58 56.39,30.58 56.49,30.48 B8ALT.P$4 56.69,30.58 65.33,30.58 65.43,30.48 B8.P$4 | 13.92,10.97 12.19,12.7 B1.P$4 | 13.92,10.97 19.81,5.08 B2.P$4 21.03,4.98 21.64,4.37 26.01,4.37 28.14,6.5 v33.73,6.5 | 13.92,10.97 15.34,12.39 18.29,12.39 20.83,14.94 20.83,22.86 B6.P$4
  Bottom 0.406: B15.1 128.52,8.74 128.83,8.74 130.05,7.52 131.88,7.52 133.2,8.84 JP5.1 133.3,9.04 133.3,11.38 JP5.2 133.4,11.48 133.4,13.92 JP5.3 133.3,14.02 133.3,16.46 JP5.4 | B14.1 128.52,21.23 128.73,21.23 133.4,16.56 JP5.4 | JP5.4 133.6,16.66 136.04,16.66 140.61,21.23 140.92,21.23 B17.1 141.12,21.44 144.17,24.49 144.17,27.94 141.02,31.09 141.02,33.73 B16.1 | B13.1 128.42,33.73 128.12,33.73 127,32.61 117.14,32.61 116.03,33.73 B10.1 | IC5.10 94.49,33.12 94.49,34.04 94.79,34.34 94.79,34.75 C4.1 95,34.85 97.23,34.85 97.43,35.05 99.47,35.05 102.41,32.11 U$21.P$1 | 103.94,16.46 104.24,16.15 104.24,15.65 IC4.23 104.14,15.44 104.14,12.6 99.97,8.43 C5.2 | 103.94,16.46 103.83,16.56 103.23,16.56 102.92,16.26 102.92,15.65 IC4.25 | 103.94,16.46 104.04,16.56 105.87,16.56 109.42,20.12 109.42,21.23 IC4.14 109.42,21.44 109.63,21.44 110.64,22.45 114.5,22.45 114.91,22.05 | 114.91,22.05 115.62,21.34 115.93,21.34 B11.1 116.13,21.13 117.35,19.91 117.35,18.29 119.18,16.46 119.18,13.72 116.03,10.57 116.03,8.84 B12.1 | 98.45,8.23 IC3.14 | IC3.14 98.65,8.23 99.77,8.23 C5.2 | B9.P$4 94.59,14.02 97.13,11.48 C7.2 97.13,11.28 97.13,10.57 98.45,9.25 98.45,8.43 IC3.14 | C5.2 99.97,8.23 102.41,5.79 102.41,3.56 U$18.P$1 | JP3.1 116.84,29.67 119.18,27.33 119.18,26.31 114.91,22.05 | 81.89,29.87 80.26,31.5 80.26,32.11 | 81.89,29.87 JP1.4 | 80.26,32.11 80.26,34.14 POT1.3 | 81.89,29.87 78.13,26.11 JP1.1 | B8.P$4 72.85,30.48 74.37,32 U$20.P$1 74.57,32.11 80.26,32.11 | 33.93,6.71 35.15,5.49 35.15,4.47 | 33.93,6.71 32.72,7.92 32.72,8.84 31.9,9.65 31.29,9.65 IC2.23 | 35.15,4.47 35.15,3.25 C2.2
  Bottom 0.406: 35.15,4.47 36.98,4.47 IC2.14 | v33.73,6.5 33.93,6.71 | B5.P$4 17.17,30.48 19.81,27.84 19.81,23.88 20.73,22.96 B6.P$4 24.79,22.86 24.99,22.66 30.38,22.66 IC1.15 30.58,22.66 34.24,22.66 36.88,25.3 37.59,25.3 IC1.10 37.8,25.3 38.71,25.3 39.42,24.59 39.62,24.59 C1.1 39.62,13.01 | IC2.25 31.29,11.07 32.82,11.07 34.85,13.11 36.88,13.11 36.98,13.01 IC2.1 37.29,13.01 39.62,13.01 | 39.62,13.01 47.35,13.01 47.65,12.7 B3.P$4 47.85,12.8 52.63,12.8 52.73,12.7 B4ALT.P$4 56.69,12.8 65.33,12.8 B4.P$4 69.49,12.7 70.61,11.58 SERIAL.1 70.81,11.48 71.12,11.18 71.12,8.74 C3.2 71.22,8.53 71.22,6.71 74.37,3.56 U$15.P$1 73.46,4.57 78.13,9.25 JP2.1 78.13,9.45 81.08,6.5 | 81.08,6.5 81.08,5.49 C6.2 | IC3.4 92.05,8.23 92.56,8.23 IC3.5 92.56,8.03 92.56,7.32 | 92.56,3.35 92.96,3.35 93.27,3.05 93.27,2.44 IC3.23 | 92.56,3.35 92.25,3.35 91.95,3.05 91.95,2.44 IC3.25 | 92.56,3.35 92.56,5.69 | 92.56,5.69 92.56,7.32 | 88.49,8.33 90.02,8.33 IC3.1 | 88.49,8.33 87.38,9.45 85.75,9.45 JP2.4 | 92.56,5.69 90.93,5.69 88.39,8.23 88.49,8.33 | B9ALT.P$4 84.43,13.92 84.43,10.87 85.65,9.65 JP2.4 | 81.08,6.5 81.18,6.6 82.19,6.6 85.34,9.75 JP2.4 | 92.56,7.32 98.15,7.32 98.45,7.62 98.45,8.03 IC3.14
  pour Top: 0,0 146.05,0 146.05,35.56 0,35.56
  pour Bottom: 0,0 146.05,0 146.05,35.56 0,35.56
GPA0  (via drill 0.41)
  Top 0.203: v35.15,26.01 35.46,26.01 35.76,26.31 38.61,26.31 43.28,21.64 55.27,21.64 56.49,22.86 B8ALT.P$5 B8.P$5
  Bottom 0.203: v35.15,26.01 34.65,26.52 30.58,26.52 IC1.21
GPA1  (via drill 0.41)
  Top 0.203: v34.24,27.64 38.61,27.64 39.32,28.35 39.93,28.35 41.55,26.72 41.55,23.98 42.67,22.86 B7.P$5
  Bottom 0.203: v34.24,27.64 33.93,27.33 30.58,27.33 IC1.22
GPA2
  Bottom 0.203: B6.P$5 27.13,30.48 29.67,27.94 30.48,27.94 IC1.23
GPA3  (via drill 0.41)
  Top 0.203: v23.37,31.19 19.71,27.53 v16.87,27.53
  Bottom 0.203: v23.37,31.19 27.03,31.19 29.67,28.55 30.48,28.55 IC1.24 | v16.87,27.53 12.19,22.86 B5.P$5
GPA4  (via drill 0.41)
  Top 0.203: v31.9,29.26 30.58,29.26 25.81,34.04 17.48,34.04 11.38,27.94 7.11,27.94 6.4,27.23 6.4,14.43 12.09,8.74 12.09,5.08 B1.P$5
  Bottom 0.203: v31.9,29.26 30.58,29.26 IC1.25
GPA5  (via drill 0.41)
  Top 0.203: v26.72,32.11 20.73,32.11 v17.58,28.96
  Bottom 0.203: v26.72,32.11 28.96,29.87 30.48,29.87 IC1.26 | v17.58,28.96 17.58,18.19 20.83,14.94 20.83,12.7 B2.P$5
GPA6  (via drill 0.41)
  Top 0.203: v48.26,16.97 48.26,13.92 48.97,13.21 48.97,6.3 47.75,5.08 B3.P$5
  Bottom 0.203: v48.26,16.97 48.26,20.52 48.97,21.23 48.97,30.99 48.26,31.7 29.67,31.7 29.46,31.5 29.46,30.79 29.67,30.58 30.48,30.58 IC1.27
GPA7  (via drill 0.41)
  Top 0.203: v36.07,25.6 38.71,25.6 46.63,17.68 48.56,17.68 56.49,9.75 56.49,5.08 B4ALT.P$5 B4.P$5
  Bottom 0.203: v36.07,25.6 36.07,26.82 31.8,31.09 30.58,31.09 IC1.28
GPA12  (via drill 0.41)
  Top 0.203: v41.86,28.45 42.16,28.45 42.67,27.94 72.03,27.94 74.27,25.7 v74.27,25.6
  Bottom 0.203: v41.86,28.45 37.8,28.45 IC1.5 | v74.27,25.6 74.57,25.6 78.54,21.64 84.33,21.64 B9ALT.P$5 84.43,21.64 85.14,22.35 92.25,22.35 92.96,21.64 94.49,21.64 B9.P$5
GPAS0  (via drill 0.41)
  Top 0.203: v93.98,24.28 93.98,23.98 95,22.96 98.55,22.96 101.91,19.61 v101.91,19.2 | v104.34,20.32 104.34,20.73 102.72,22.35 102.72,22.96 105.36,25.6 112.88,25.6 114,26.72 B10.2 | JP3.2 118.67,30.48 117.35,29.16 116.03,29.16 v115.93,29.26
  Bottom 0.203: v93.98,24.28 93.17,25.09 93.17,25.81 IC5.21 | v101.91,19.2 103.33,19.2 104.34,20.22 v104.34,20.32 | v115.93,29.26 115.93,28.65 114.1,26.82 B10.2
GPAS1  (via drill 0.41)
  Top 0.203: v94.49,27.33 99.67,27.33 100.08,27.74 110.44,27.74 v110.74,27.43 | v122.63,21.23 117.65,16.26 116.43,16.26 114.5,14.33 114.1,14.33 B11.2
  Bottom 0.203: v94.49,27.33 93.27,27.33 92.56,26.62 92.56,25.91 IC5.22 | v110.74,27.43 111.15,27.43 115.52,31.8 123.14,31.8 JP3.4 124.36,30.48 122.63,28.75 v122.63,21.23
GPAS2  (via drill 0.41)
  Top 0.203: v91.44,24.49 91.64,24.49 92.35,25.2 96.93,25.2 110.03,12.09 110.03,5.79 113.03,2.79 | 113.03,2.79 114,1.83 B12.2 | JP4.2 118.67,5.08 116.43,2.85 113.08,2.85 113.03,2.79
  Bottom 0.203: v91.44,24.49 91.85,24.89 91.85,25.81 IC5.23
GPAS3  (via drill 0.41)
  Top 0.203: v92.56,27.94 94.08,27.94 94.28,28.14 125.17,28.14 125.63,27.69 | 125.63,27.69 126.49,26.82 B13.2 | JP3.5 127,29.06 125.63,27.69
  Bottom 0.203: v92.56,27.94 91.24,26.62 91.24,25.91 IC5.24
GPAS4  (via drill 0.41)
  Top 0.203: v87.78,31.6 88.19,31.6 89,32.41 97.03,32.41 v99.16,30.28 | v110.13,33.73 110.44,33.73 111.86,35.15 130.66,35.15 132.08,33.73 JP3.7 130.25,28.65 v130.25,28.45
  Bottom 0.203: v87.78,31.6 87.78,25.2 88.29,24.69 90.22,24.69 90.53,24.99 90.53,25.81 IC5.25 | v99.16,30.28 99.16,29.06 100.08,28.14 104.55,28.14 v110.13,33.73 | v130.25,28.45 124.66,28.45 123.34,27.13 123.34,20.93 126.49,17.78 126.49,14.33 B14.2
GPAS5  (via drill 0.41)
  Top 0.203: v90.53,27.23 93.57,27.23 94.79,26.01 96.72,26.01 110.44,12.29 110.44,8.23 111.96,6.71 v115.21,6.71
  Bottom 0.203: v90.53,27.23 89.92,26.62 89.92,25.91 IC5.26 | v115.21,6.71 122.33,6.71 122.63,6.4 125.68,6.4 JP4.5 126.59,5.38 126.59,1.83 B15.2
GPAS6  (via drill 0.41)
  Top 0.203: v90.83,28.55 92.15,28.55 92.25,28.65 99.57,28.65 99.67,28.55 125.48,28.55 v126.09,29.16
  Bottom 0.203: v90.83,28.55 89.31,27.03 89.31,25.91 IC5.27 | v126.09,29.16 133.3,29.16 JP3.8 134.62,30.38 134.93,30.38 138.48,26.82 138.99,26.82 B16.2
GPAS7  (via drill 0.41)
  Top 0.203: v88.7,30.48 89.1,30.48 90.22,31.6 95.81,31.6 v97.43,29.97 | v100.38,27.03 104.85,27.03 105.05,27.23 106.07,27.23 v106.27,27.03 | JP3.10 140.82,30.48 144.07,27.23 144.07,20.83 139.09,15.85 139.09,14.33 B17.2
  Bottom 0.203: v88.7,30.48 88.7,25.91 IC5.28 | v100.38,27.03 v97.43,29.97 | v106.27,27.03 106.27,27.64 110.85,32.21 110.85,34.14 111.86,35.15 134.11,35.15 137.47,31.8 138.38,31.8 JP3.10
GPBS0  (via drill 0.61)
  Top 0.406: v90.73,29.57 91.03,29.57 91.44,29.16 99.77,29.16 v99.97,29.36 | v106.17,30.89 107.59,30.89 v109.12,29.36 | v108.71,23.57 105.36,20.22 105.36,18.19 113.59,9.96 131.06,9.96 131.88,9.14 131.88,7.72 134.52,5.08 JP4.8
  Bottom 0.406: v90.73,29.57 88.59,31.7 88.59,33.02 IC5.1 | v99.97,29.36 100.28,29.36 100.99,28.65 103.94,28.65 v106.17,30.89 | v109.12,29.36 109.12,23.98 v108.71,23.57 | JP4.8 136.04,3.66 136.85,3.66 138.68,1.83 138.99,1.83 B18.2
I2C_SCL  (via drill 0.41)
  Top 0.203: v30.18,17.17 30.18,13.82 | 30.18,13.82 v30.18,11.68 | v87.07,8.64 87.07,9.96 86.92,10.11 | 86.92,10.11 84.73,12.29 83.11,12.29 v81.38,14.02 | v102.11,17.98 102.11,17.68 102.31,17.48 102.31,16.76 95.81,10.26 v93.98,10.26 | 86.92,10.11 v87.17,10.36 | v97.74,34.24 87.68,34.24 84.43,30.99 84.43,23.27 85.65,22.05 85.65,21.13 84.02,19.51 v83.62,19.51 | 30.18,13.82 32.92,13.82 34.24,12.5 34.24,11.18 34.65,10.77 35.97,10.77 41.96,16.76 v41.96,16.97 | v62.08,18.69 v46.63,18.69
  Bottom 0.203: v30.18,11.68 31.19,11.68 IC2.26 | v30.18,17.17 36.98,23.98 37.69,23.98 IC1.12 | v87.07,8.64 91.24,4.47 91.24,2.44 IC3.26 | 78.13,14.02 73.36,14.02 SERIAL.4 73.25,14.12 72.03,15.34 72.03,19.61 71.22,20.42 70.31,20.42 68.58,18.69 v62.08,18.69 | 78.13,14.02 v81.38,14.02 | v102.11,17.98 102.31,17.78 102.31,15.65 IC4.26 | v93.98,10.26 93.67,10.26 93.57,10.36 v87.17,10.36 | v97.74,34.24 96.11,34.24 95.81,33.93 95.81,33.12 IC5.12 | 78.13,14.02 v83.62,19.51 | v41.96,16.97 44.91,16.97 v46.63,18.69
I2C_SDA  (via drill 0.41)
  Top 0.203: v82.19,5.18 81.18,5.18 78.13,8.23 76.1,8.23 v75.08,9.25 75.18,9.25 79.86,13.92 v79.86,14.73 | v101.19,17.68 99.97,18.9 v99.97,19 | v96.72,31.7 96.32,31.7 96.01,32 89.2,32 87.78,30.58 87.78,21.34 v87.68,21.23 | v41.05,16.87 v38.81,19.1
  Bottom 0.203: 37.95,19.96 38.91,20.93 38.91,22.96 38.61,23.27 37.8,23.27 IC1.13 | 37.95,19.96 35.76,17.78 35.76,15.04 32.92,12.19 32.31,12.19 32.21,12.29 31.29,12.29 IC2.27 | v82.19,5.18 83.41,5.18 85.04,3.56 90.02,3.56 90.63,2.95 90.63,2.44 IC3.27 | v75.08,9.25 74.17,10.16 72.85,10.16 72.03,10.97 72.03,12.8 70.81,14.02 SERIAL.3 70.71,14.12 68.58,16.26 41.66,16.26 v41.05,16.87 | v101.19,17.68 101.5,17.37 101.5,15.65 IC4.27 | v99.97,19 98.04,19 96.93,17.88 95,17.88 94.79,18.09 90.32,18.09 89.41,19 87.68,19 | 87.68,19 84.12,19 v79.86,14.73 | v96.72,31.7 96.42,32 96.42,33.02 IC5.13 | 87.68,19 v87.68,21.23 | v38.81,19.1 37.95,19.96
L0
  Bottom 0.203: R20.1 9.25,10.97 8.03,10.97 7.62,11.38 B1.P$2
L1
  Bottom 0.203: R19.1 9.25,6.81 8.03,6.81 7.62,6.4 B1.P$3
L2
  Bottom 0.203: R18.1 23.57,6.81 24.99,6.81 25.4,6.4 B2.P$2
L3
  Bottom 0.203: R17.1 23.57,10.97 24.99,10.97 25.4,11.38 B2.P$3
L4
  Bottom 0.203: R16.1 44.81,10.97 43.59,10.97 43.18,11.38 B3.P$2
L5
  Bottom 0.203: R15.1 44.81,6.81 43.59,6.81 43.18,6.4 B3.P$3
L6
  Bottom 0.203: B4ALT.P$2 52.53,10.97 53.75,10.97 R14.1 53.85,10.87 54.66,10.06 59.64,10.06 60.96,11.38 B4.P$2
L7
  Bottom 0.203: B4ALT.P$3 52.53,6.81 53.75,6.81 R13.1 53.85,6.91 54.66,7.72 59.64,7.72 60.96,6.4 B4.P$3
L8
  Bottom 0.203: R12.1 9.25,28.75 8.03,28.75 7.62,29.16 B5.P$2
L9
  Bottom 0.203: R11.1 9.25,24.59 8.03,24.59 7.62,24.18 B5.P$3
L10
  Bottom 0.203: R10.1 23.57,24.59 24.99,24.59 25.4,24.18 B6.P$2
L11
  Bottom 0.203: R9.1 23.57,28.75 24.99,28.75 25.4,29.16 B6.P$3
L12
  Bottom 0.203: R8.1 44.81,28.75 43.59,28.75 43.18,29.16 B7.P$2
L13
  Bottom 0.203: R7.1 44.81,24.59 43.59,24.59 43.18,24.18 B7.P$3
L14
  Top 0.203: B8ALT.P$2 52.12,29.26 60.96,29.26 B8.P$2
  Bottom 0.203: B8ALT.P$2 52.53,28.75 53.75,28.75 R6.1
L15
  Top 0.203: B8ALT.P$3 52.12,24.18 60.96,24.18 B8.P$3
  Bottom 0.203: B8ALT.P$3 52.53,24.59 53.75,24.59 R5.1
L16  (via drill 0.41)
  Top 0.203: v95.4,15.24 B9.P$2
  Bottom 0.203: B9ALT.P$2 90.93,17.27 R32.1 92.56,17.27 94.59,15.24 v95.4,15.24
L17
  Bottom 0.203: B9ALT.P$3 90.22,19 92.35,19 R31.1 92.46,19 93.78,20.32 B9.P$3
LS0  (via drill 0.41)
  Top 0.203: B10.L2 116.03,26.82 117.96,26.82 B10.L1 118.72,26.06 | v116.53,18.29 119.08,20.83 119.08,25.7 118.72,26.06 | 118.72,26.06 v119.99,27.33
  Bottom 0.203: v116.53,18.29 R34.1 | JP3.3 121.92,29.26 v119.99,27.33
LS1  (via drill 0.41)
  Top 0.203: B11.L1 117.96,14.33 116.03,14.33 B11.L2 | JP4.4 123.75,5.08 122.43,3.76 v118.36,3.76
  Bottom 0.203: B11.L2 115.93,14.22 110.34,8.64 R33.1 110.54,8.74 115.52,3.76 v118.36,3.76
LS2
  Top 0.203: B12.L1 117.96,1.83 116.03,1.83 B12.L2
  Bottom 0.203: R30.1 110.13,7.21 110.54,7.21 115.93,1.83 B12.L2 | JP4.3 121.31,5.08 118.06,1.83 B12.L1
LS3  (via drill 0.41)
  Top 0.203: 129.54,26.82 128.52,26.82 B13.L2 128.42,26.72 127.41,25.7 126.09,25.7 v117.45,17.07 | 129.54,26.82 130.45,26.82 B13.L1 | 129.54,26.82 JP3.6
  Bottom 0.203: v117.45,17.07 112.67,17.07 R29.1
LS4  (via drill 0.41)
  Top 0.203: v111.25,10.57 111.25,9.55 110.85,9.14 110.85,8.43 111.66,7.62 v115.21,7.62 | B14.L1 130.45,14.33 128.52,14.33 B14.L2
  Bottom 0.203: v111.25,10.57 110.74,10.06 110.13,10.06 R28.1 | v115.21,7.62 121.82,7.62 121.87,7.67 | 121.87,7.67 128.42,14.22 B14.L2 | JP4.7 131.37,5.08 128.83,7.62 121.92,7.62 121.87,7.67
LS5
  Top 0.203: 129.54,1.83 128.52,1.83 B15.L2 | 129.54,1.83 130.45,1.83 B15.L1 | 129.54,1.83 JP4.6
  Bottom 0.203: R27.1 110.13,5.79 110.64,5.28 110.74,5.28 110.95,5.08 110.95,2.23 110.85,2.13 110.85,1.42 111.56,0.71 127.41,0.71 128.42,1.73 B15.L2
LS6  (via drill 0.41)
  Top 0.203: B16.L1 142.95,26.82 141.02,26.82 B16.L2 140.92,26.82 140.72,26.82 138.33,29.21 | 138.33,29.21 137.16,30.38 JP3.9 | v118.16,15.75 123.34,20.93 123.34,21.64 127,25.3 130.56,25.3 132.18,26.92 132.18,27.23 134.11,29.16 138.28,29.16 138.33,29.21
  Bottom 0.203: v118.16,15.75 R26.1
LS7  (via drill 0.41)
  Top 0.203: v112.67,11.99 118.36,11.99 119.69,10.67 130.86,10.67 132.89,12.7 139.4,12.7 140.92,14.22 B17.L2 141.02,14.33 142.95,14.33 B17.L1
  Bottom 0.203: v112.67,11.99 112.17,11.48 110.13,11.48 R25.1 | JP4.10 140.82,5.08 144.07,8.33 144.07,13.21 143.05,14.22 B17.L1
LS8  (via drill 0.41)
  Top 0.203: B18.L1 142.95,1.83 141.02,1.83 B18.L2 140.92,1.83 140.51,1.83 137.36,4.98 137.16,4.98 JP4.9 132.79,0.71 111.56,0.71 v110.13,2.13
  Bottom 0.203: v110.13,2.13 110.13,4.37 R24.1
N$1  (via drill 0.41)
  Top 0.203: v108.31,20.12 108.31,18.09 108.92,17.48 108.92,15.75 v110.03,14.63
  Bottom 0.203: v108.31,20.12 108.71,20.52 108.71,21.44 IC4.13 | v110.03,14.63 110.03,13.11 108.41,11.48 R25.2
N$2  (via drill 0.41)
  Top 0.203: v108.81,22.55 108.81,20.62 109.63,19.81 v109.63,16.76
  Bottom 0.203: v108.81,22.55 108.71,22.55 108.1,21.95 108.1,21.54 IC4.12 | v109.63,16.76 110.64,15.75 R26.2
N$3  (via drill 0.41)
  Top 0.203: v95.5,30.89 90.12,30.89 89,29.77 v89,23.98 | v90.53,23.37 90.53,22.05 92.96,19.61 v96.22,19.61 | v97.64,19.61 97.64,17.48 98.65,16.46 v99.97,16.46 | v101.09,10.67 102.72,10.67 107.09,6.3 v107.19,6.3
  Bottom 0.203: v95.5,30.89 100.79,25.6 106.68,25.6 107.8,24.49 107.8,23.47 107.49,23.16 107.49,21.54 IC4.11 | v89,23.98 89.92,23.98 v90.53,23.37 | v97.64,19.61 v96.22,19.61 | v99.97,16.46 99.97,16.05 100.28,15.75 100.28,11.48 v101.09,10.67 | v107.19,6.3 107.9,6.3 108.31,5.89 R27.2
N$4
  Bottom 0.203: IC2.13 37.08,5.08 42.06,5.08 43.28,3.86 52.53,3.86 55.47,6.81 R13.2
N$5  (via drill 0.41)
  Top 0.203: v35.97,5.89 35.97,6.91 42.06,13.01 v42.06,13.82 | v56.59,10.97 v53.65,13.92
  Bottom 0.203: v35.97,5.89 36.98,5.89 IC2.12 | v42.06,13.82 47.04,13.82 47.14,13.92 v53.65,13.92 | v56.59,10.97 55.58,10.97 R14.2
N$6  (via drill 0.41)
  Top 0.203: v103.73,17.37 103.73,14.53 107.19,11.07 v107.19,10.77
  Bottom 0.203: v103.73,17.37 103.94,17.58 105.66,17.58 106.88,18.8 106.88,19.41 106.78,19.51 106.78,21.44 IC4.10 | v107.19,10.77 107.49,10.77 108.31,9.96 R28.2
N$7
  Bottom 0.203: IC2.11 37.08,6.4 41.35,6.4 42.67,5.08 44.81,5.08 46.53,6.81 R15.2
N$8  (via drill 0.41)
  Top 0.203: v107.9,17.48 v106.17,19.2
  Bottom 0.203: v106.17,19.2 106.17,21.44 IC4.9 | v107.9,17.48 110.44,17.48 110.85,17.07 R29.2
N$9  (via drill 0.41)
  Top 0.203: v39.73,7.21 42.67,10.16 43.69,10.16 v45.52,11.99
  Bottom 0.203: v39.73,7.21 37.08,7.21 IC2.10 | v45.52,11.99 46.53,10.97 R16.2
N$10  (via drill 0.41)
  Top 0.203: v35.76,7.72 30.68,7.72 29.97,7.01 27.84,7.01 25.91,5.08 24.89,5.08 22.45,7.52 v22.45,9.86
  Bottom 0.203: v35.76,7.72 36.98,7.72 IC2.9 | v22.45,9.86 22.45,10.26 21.84,10.87 R17.2
N$11  (via drill 0.41)
  Top 0.203: v34.24,8.43 30.79,8.43 29.97,7.62 23.47,7.62 v23.16,7.92
  Bottom 0.203: v34.24,8.43 36.98,8.43 IC2.8 | v23.16,7.92 22.86,7.92 21.84,6.91 R18.2
N$12  (via drill 0.41)
  Top 0.203: v38.71,7.92 38.71,7.01 33.22,1.52 17.48,1.52 v13.61,5.38
  Bottom 0.203: v38.71,7.92 37.59,9.04 37.08,9.04 IC2.7 | v13.61,5.38 12.19,6.81 11.07,6.81 R19.2
N$13  (via drill 0.41)
  Top 0.203: v94.59,29.97 91.44,29.97 90.93,30.48 90.32,30.48 89.71,29.87 89.71,21.23 90.12,20.83 v90.12,13.01 | v91.44,11.68 91.44,10.46 92.96,8.94 95.5,8.94 98.04,11.48 102.92,11.48 v107.19,7.21
  Bottom 0.203: v94.59,29.97 95.81,29.97 100.58,25.2 106.48,25.2 107.39,24.28 107.39,23.67 106.98,23.27 106.78,23.27 105.56,22.05 105.56,21.54 IC4.8 | v91.44,11.68 v90.12,13.01 | v107.19,7.21 108.31,7.21 R30.2
N$14  (via drill 0.41)
  Top 0.203: v95.3,18.59 v91.75,15.04
  Bottom 0.203: v91.75,15.04 93.78,13.01 93.78,11.48 94.69,10.57 94.69,9.96 93.98,9.25 93.98,8.33 IC3.7 | v95.3,18.59 94.49,18.59 94.18,18.9 R31.2
N$15  (via drill 0.41)
  Top 0.203: v93.27,9.65 93.27,10.57 93.78,11.07 93.78,13.01 93.27,13.51 93.27,14.53 v94.79,16.05
  Bottom 0.203: v93.27,9.65 93.27,8.33 IC3.6 | v94.79,16.05 94.79,16.66 94.18,17.27 R32.2
N$16  (via drill 0.41)
  Top 0.203: v103.02,17.98 103.02,12.39 v107.19,8.23
  Bottom 0.203: v103.02,17.98 105.05,20.02 105.05,20.62 104.85,20.83 104.85,21.44 IC4.7 | v107.19,8.23 107.9,8.23 108.31,8.64 R33.2
N$17  (via drill 0.41)
  Top 0.203: v106.68,23.98 107.8,25.09 v113.79,25.09 | v111.96,23.27 111.96,22.76 110.85,21.64 v110.85,19.41
  Bottom 0.203: v106.68,23.98 105.77,23.06 105.26,23.06 104.24,22.05 104.24,21.54 IC4.6 | v111.96,23.27 v113.79,25.09 | v110.85,19.41 110.85,18.29 R34.2
N$18
  Bottom 0.203: IC4.15 109.32,15.54 109.32,13.92 106.48,11.07 106.48,5.99 108,4.47 108.31,4.47 R24.2
N$19  (via drill 0.41)
  Top 0.203: v34.14,9.55 31.29,9.55 30.07,8.33 27.74,8.33 25.91,10.16 23.16,10.16 22.35,10.97 v15.04,10.97
  Bottom 0.203: v34.14,9.55 34.24,9.65 36.98,9.65 IC2.6 | v15.04,10.97 11.07,10.97 R20.2
N$20  (via drill 0.41)
  Top 0.203: v25.6,3.56 19.51,3.56 10.87,12.19 v10.87,25.91
  Bottom 0.203: v25.6,3.56 26.52,4.47 31.19,4.47 IC2.15 | v10.87,25.91 10.87,28.55 10.97,28.65 R12.2
N$21  (via drill 0.41)
  Top 0.203: v22.45,5.18 22.45,6.3 v18.49,10.26
  Bottom 0.203: v22.45,5.18 22.96,4.67 26.11,4.67 26.52,5.08 31.19,5.08 IC2.16 | v18.49,10.26 18.49,11.68 15.04,15.14 15.04,17.78 10.87,21.95 10.87,24.49 10.97,24.59 R11.2
N$22  (via drill 0.41)
  Top 0.203: v23.16,5.79 23.16,6.2 21.34,8.03 v21.34,9.86 | v17.98,13.21 17.98,21.74 v20.62,24.38
  Bottom 0.203: v23.16,5.79 23.88,5.08 25.91,5.08 26.62,5.79 31.19,5.79 IC2.17 | v17.98,13.21 v21.34,9.86 | v20.62,24.38 21.54,24.38 21.74,24.59 R10.2
N$23
  Bottom 0.203: IC2.18 31.29,6.4 31.8,6.4 32.11,6.1 32.11,4.27 31.29,3.45 26.52,3.45 24.59,1.52 10.67,1.52 6.4,5.79 6.4,29.77 8.33,31.7 17.88,31.7 20.83,28.75 21.74,28.75 R9.2
N$24  (via drill 0.41)
  Top 0.203: v28.35,13.31 v28.35,9.45 | v40.44,21.64 v36.68,21.64
  Bottom 0.203: v28.35,9.45 30.58,7.21 31.19,7.21 IC2.19 | v36.68,21.64 v28.35,13.31 | v40.44,21.64 40.44,23.16 42.67,25.4 43.69,25.4 46.53,28.25 46.53,28.65 R8.2
N$25  (via drill 0.41)
  Top 0.203: v32.92,5.28 33.63,4.57 35.66,4.57 38,6.91 38,8.33 42.77,13.11 v42.77,20.42
  Bottom 0.203: v32.92,5.28 32.92,6.6 31.8,7.72 31.29,7.72 IC2.20 | v42.77,20.42 46.53,24.18 46.53,24.59 R7.2
N$26  (via drill 0.41)
  Top 0.203: v29.77,9.04 29.77,11.07 29.46,11.38 29.46,22.96 31.6,25.09 35.56,25.09 38.3,22.35 40.95,22.35 v41.35,21.95 | v44.91,23.57 46.63,23.57 47.45,24.38 v50.6,24.38
  Bottom 0.203: v29.77,9.04 30.38,8.43 31.19,8.43 IC2.21 | v41.35,21.95 43.28,21.95 v44.91,23.57 | v50.6,24.38 51.61,25.4 52.53,25.4 55.47,28.35 55.47,28.65 R6.2
N$27  (via drill 0.41)
  Top 0.203: v28.96,27.64 33.22,27.64 34.34,28.75 40.13,28.75 41.96,26.92 41.96,26.11 42.67,25.4 54.15,25.4 v54.46,25.7 | v29.06,26.01 v29.06,10.77
  Bottom 0.203: v29.06,10.77 30.68,9.14 31.19,9.14 IC2.22 | v29.06,26.01 29.06,27.53 v28.96,27.64 | v54.46,25.7 55.47,24.69 R5.2
SLIDER_IN
  Top 0.203: 76.81,22.25 74.68,22.25 72.03,19.61 72.03,18.59 70.81,17.37 70.81,16.66 SERIAL.5 | 76.81,22.25 80.57,26.01 JP1.2 | 80.57,15.85 80.57,18.49 76.81,22.25 | 80.57,15.85 80.57,9.55 JP2.2 | 80.57,15.85 83.72,12.7 85.85,12.7 87.88,10.67 87.88,4.67 84.63,1.42 83.72,1.42 POT1.2A
  Bottom 0.203: C6.1 81.18,3.66 81.38,3.66 83.62,1.42 POT1.2A

### Text on the board
_bsilk: v08-13 | PCB-CMB-3 | SKAARHOJ 2013 | GITHUB: SKAARHOJ-Open-Engineering